# EAGLE schematic AC-CTRL-BRD (EAGLE 9.6.2)
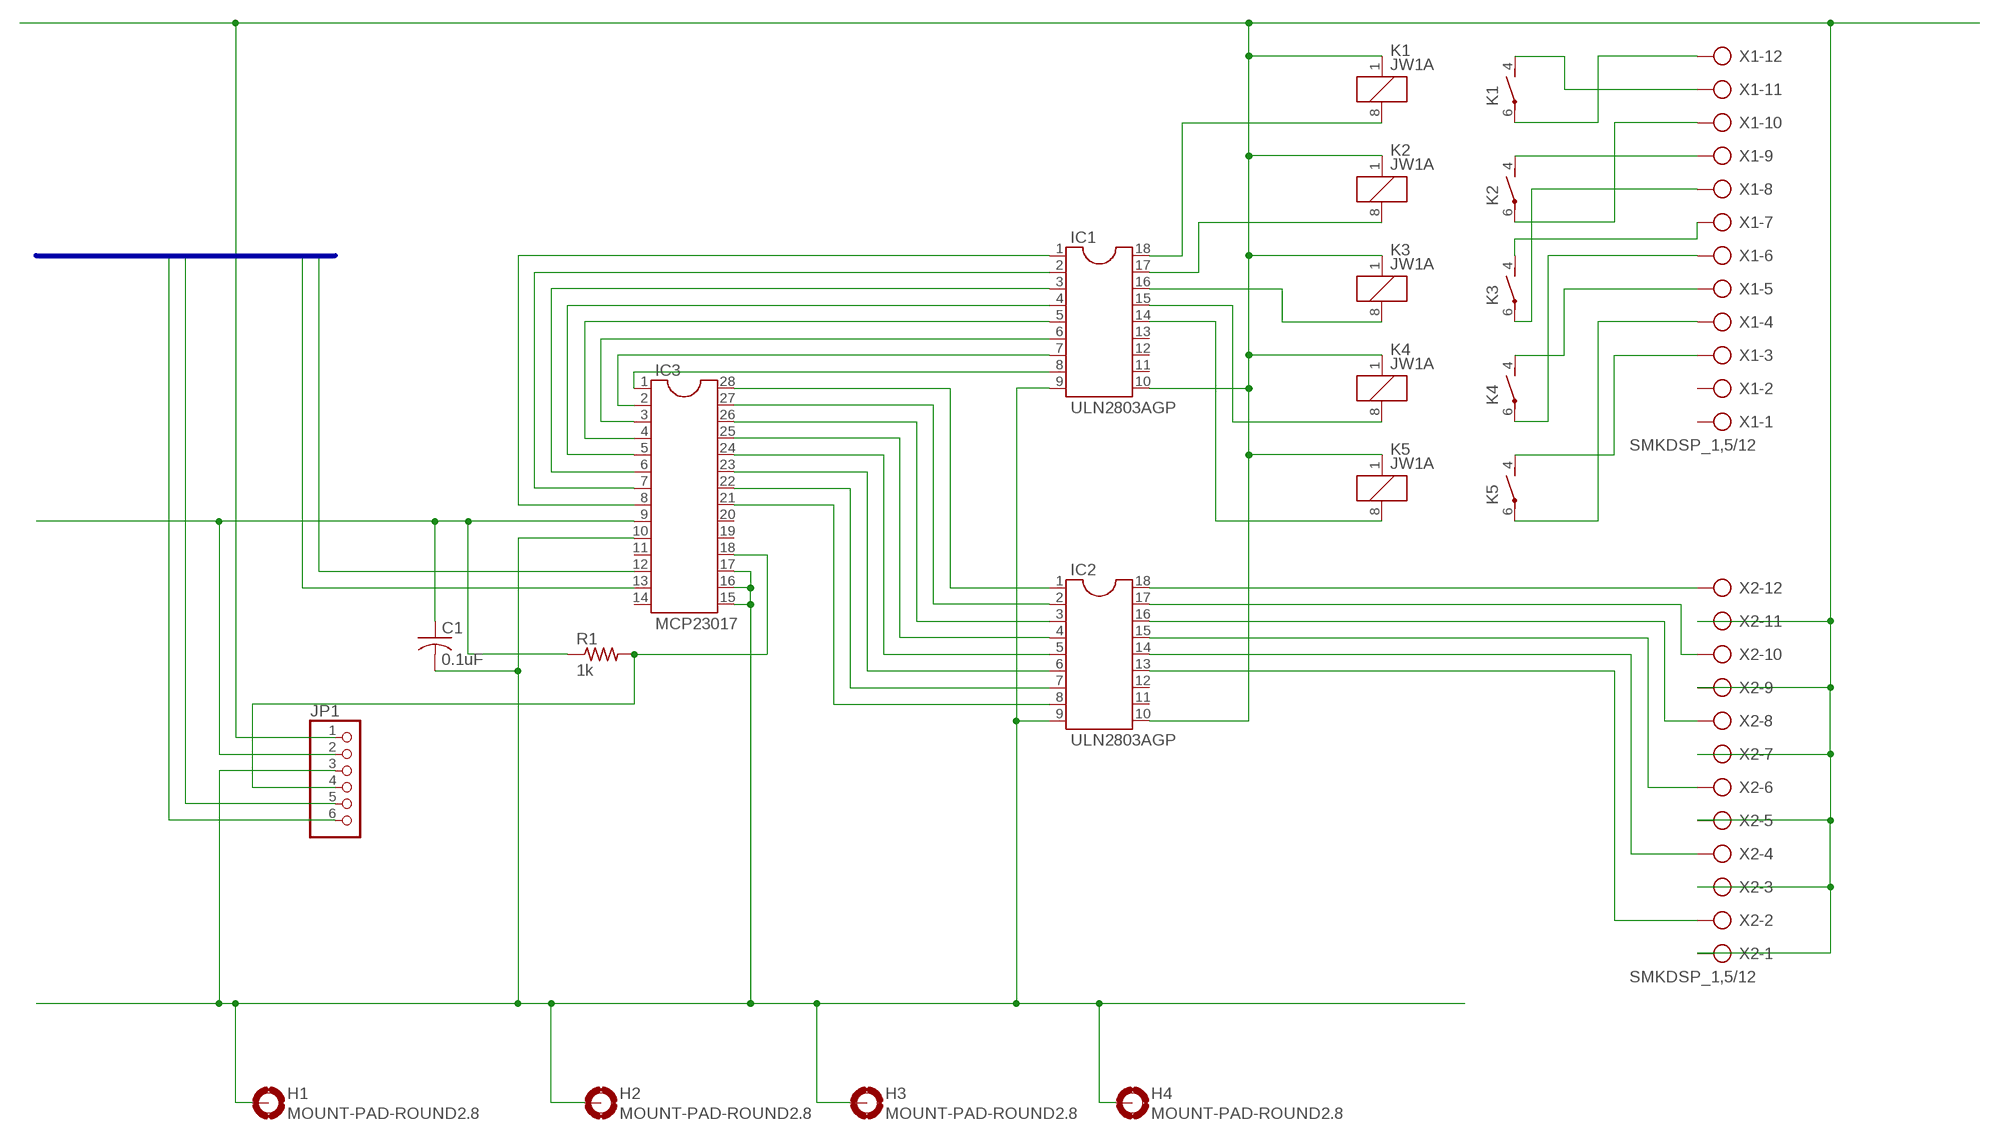
[diagram p0: schematic, sheet 1]

## Parts
C1  0.1uF  C-US050-024X044  [C050-024X044]
H1  MOUNT-PAD-ROUND2.8  [2,8-PAD]
H2  MOUNT-PAD-ROUND2.8  [2,8-PAD]
H3  MOUNT-PAD-ROUND2.8  [2,8-PAD]
H4  MOUNT-PAD-ROUND2.8  [2,8-PAD]
IC1  ULN2803AGP  DIL18  [DIL18]
IC2  ULN2803AGP  DIL18  [DIL18]
IC3  MCP23017  DIL28-3  [DIL28-3]
JP1  PINHD-1X6  [1X06]
K1  JW1A  [JW1A]
K2  JW1A  [JW1A]
K3  JW1A  [JW1A]
K4  JW1A  [JW1A]
K5  JW1A  [JW1A]
R1  1k  R-US_0204/7  [0204/7]
X1  SMKDSP_1,5/12  [SMKDSP_1,5/12]
X2  SMKDSP_1,5/12  [SMKDSP_1,5/12]

## Nets
5V: C1.1 IC3.9 JP1.2 R1.1
12V: IC1.10 IC2.10 JP1.1 K1.1 K2.1 K3.1 K4.1 K5.1 X2.1 X2.3 X2.5 X2.7 X2.9 X2.11
GROUND: C1.2 H1.B2,8(MOUNT) H2.B2,8(MOUNT) H3.B2,8(MOUNT) H4.B2,8(MOUNT) IC1.9 IC2.9 IC3.10 IC3.15 IC3.16 IC3.17 JP1.3
N$1: IC2.7 IC3.22
N$2: IC1.18 K1.8
N$3: IC1.17 K2.8
N$4: IC1.16 K3.8
N$5: IC1.15 K4.8
N$6: IC1.14 K5.8
N$7: IC2.8 IC3.21
N$8: IC2.6 IC3.23
N$9: IC2.5 IC3.24
N$10: IC2.4 IC3.25
N$11: IC2.3 IC3.26
N$12: IC2.2 IC3.27
N$13: IC2.1 IC3.28
N$14: IC1.8 IC3.1
N$15: IC1.7 IC3.2
N$16: IC1.6 IC3.3
N$17: IC1.5 IC3.4
N$18: IC1.4 IC3.5
N$19: IC1.3 IC3.6
N$20: IC1.2 IC3.7
N$21: IC1.1 IC3.8
N$22: IC3.18 JP1.4 R1.2
N$23: K1.4(1:S) X1.11
N$24: K1.6(1:P) X1.12
N$25: K2.4(1:S) X1.9
N$26: K2.6(1:P) X1.10
N$27: K3.4(1:S) X1.7
N$28: K3.6(1:P) X1.8
N$29: K4.4(1:S) X1.5
N$30: K4.6(1:P) X1.6
N$31: K5.6(1:P) X1.4
N$32: K5.4(1:S) X1.3
N$33: IC2.18 X2.12
N$34: IC2.17 X2.10
N$35: IC2.16 X2.8
N$36: IC2.15 X2.6
N$37: IC2.14 X2.4
N$38: IC2.13 X2.2
SCL: IC3.12 JP1.6
SDA: IC3.13 JP1.5
Unconnected: IC1.11 IC1.12 IC1.13 IC2.11 IC2.12 IC3.11 IC3.14 IC3.19 IC3.20 X1.1 X1.2

## Buses
I2C:SCL,SDA

## Library data of the parts
C1 = rcl:C-US: CAPACITOR, American symbol; SPICEPREFIX: C
H1-H4 = holes:MOUNT-PAD-ROUND: MOUNTING PAD, round
IC1 IC2 = ic-package:DIL18: Dual In Line / Socket
IC3 = ic-package:DIL28: Dual In Line
JP1 = pinhead:PINHD-1X6: PIN HEADER
K1-K5 = relay:JW1A: Power relay Source: Panasonic Electric Works Co., Ltd. / jw.catalog.pdf
R1 = rcl:R-US_: RESISTOR, American symbol; SPICEPREFIX: R
X1 X2 = con-phoenix-smkdsp:SMKDSP_1,5/12: Printklemme, Nennstrom: 17,5 A, Bemessungsspannung: 250 V, Raster: 5,0 mm Source: http://eshop.phoenixcontact.de .. 1733415.pdf; OC_FARNELL: unknown; OC_NEWARK: unknown